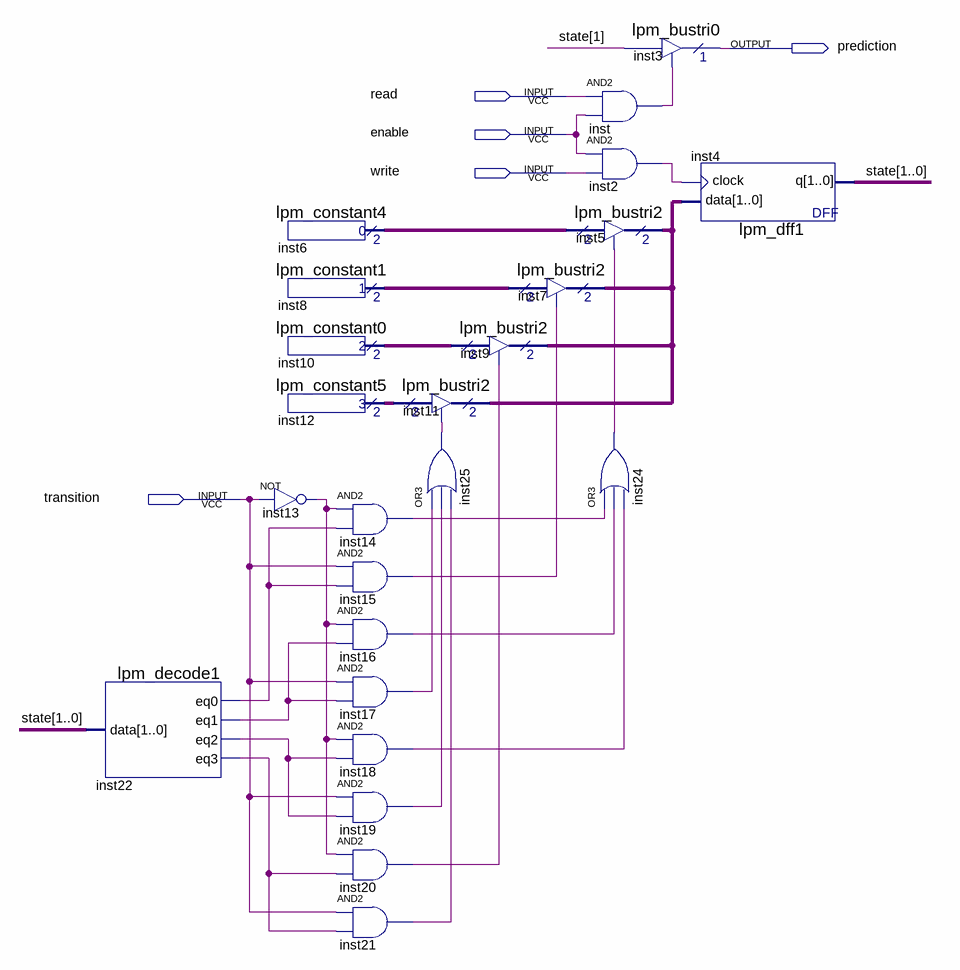
[diagram p0: schematic sheet]
// Quartus schematic A4.bdf as structural Verilog: 24 symbols, 5 pins
module A4 (
  input  read,
  input  enable,
  input  write,
  input  transition,
  output prediction
);

  wire inst2_out, inst13_out, inst14_out, inst15_out, inst16_out, inst17_out, inst18_out, inst19_out,
       inst20_out, inst21_out, inst22_eq0, inst22_eq1, inst22_eq2, inst22_eq3, inst24_out, inst25_out,
       inst_out;
  wire [1:0] inst6_result, inst8_result, inst9_tridata, inst10_result, inst12_result, state;

  lpm_decode1 inst22 (.data(state), .eq0(inst22_eq0), .eq1(inst22_eq1), .eq2(inst22_eq2), .eq3(inst22_eq3));
  lpm_constant4 inst6 (.result(inst6_result));
  lpm_constant1 inst8 (.result(inst8_result));
  lpm_constant0 inst10 (.result(inst10_result));
  lpm_constant5 inst12 (.result(inst12_result));
  not inst13 (inst13_out, transition);
  and inst14 (inst14_out, inst13_out, inst22_eq0);
  and inst15 (inst15_out, transition, inst22_eq0);
  and inst16 (inst16_out, inst13_out, inst22_eq1);
  and inst17 (inst17_out, transition, inst22_eq1);
  and inst18 (inst18_out, inst13_out, inst22_eq2);
  and inst19 (inst19_out, transition, inst22_eq2);
  and inst20 (inst20_out, inst13_out, inst22_eq3);
  and inst21 (inst21_out, transition, inst22_eq3);
  lpm_bustri2 inst9 (.enabledt(inst20_out), .data(inst10_result), .tridata(inst9_tridata));
  lpm_bustri2 inst11 (.enabledt(inst25_out), .data(inst12_result), .tridata(inst9_tridata));
  or inst25 (inst25_out, inst17_out, inst19_out, inst21_out);
  lpm_bustri2 inst7 (.enabledt(inst15_out), .data(inst8_result), .tridata(inst9_tridata));
  and inst (inst_out, read, enable);
  and inst2 (inst2_out, enable, write);
  lpm_bustri2 inst5 (.enabledt(inst24_out), .data(inst6_result), .tridata(inst9_tridata));
  or inst24 (inst24_out, inst14_out, inst16_out, inst18_out);
  lpm_bustri0 inst3 (.enabledt(inst_out), .data(state[1]), .tridata(prediction));
  lpm_dff1 inst4 (.data(inst9_tridata), .clock(inst2_out), .q(state));
endmodule
